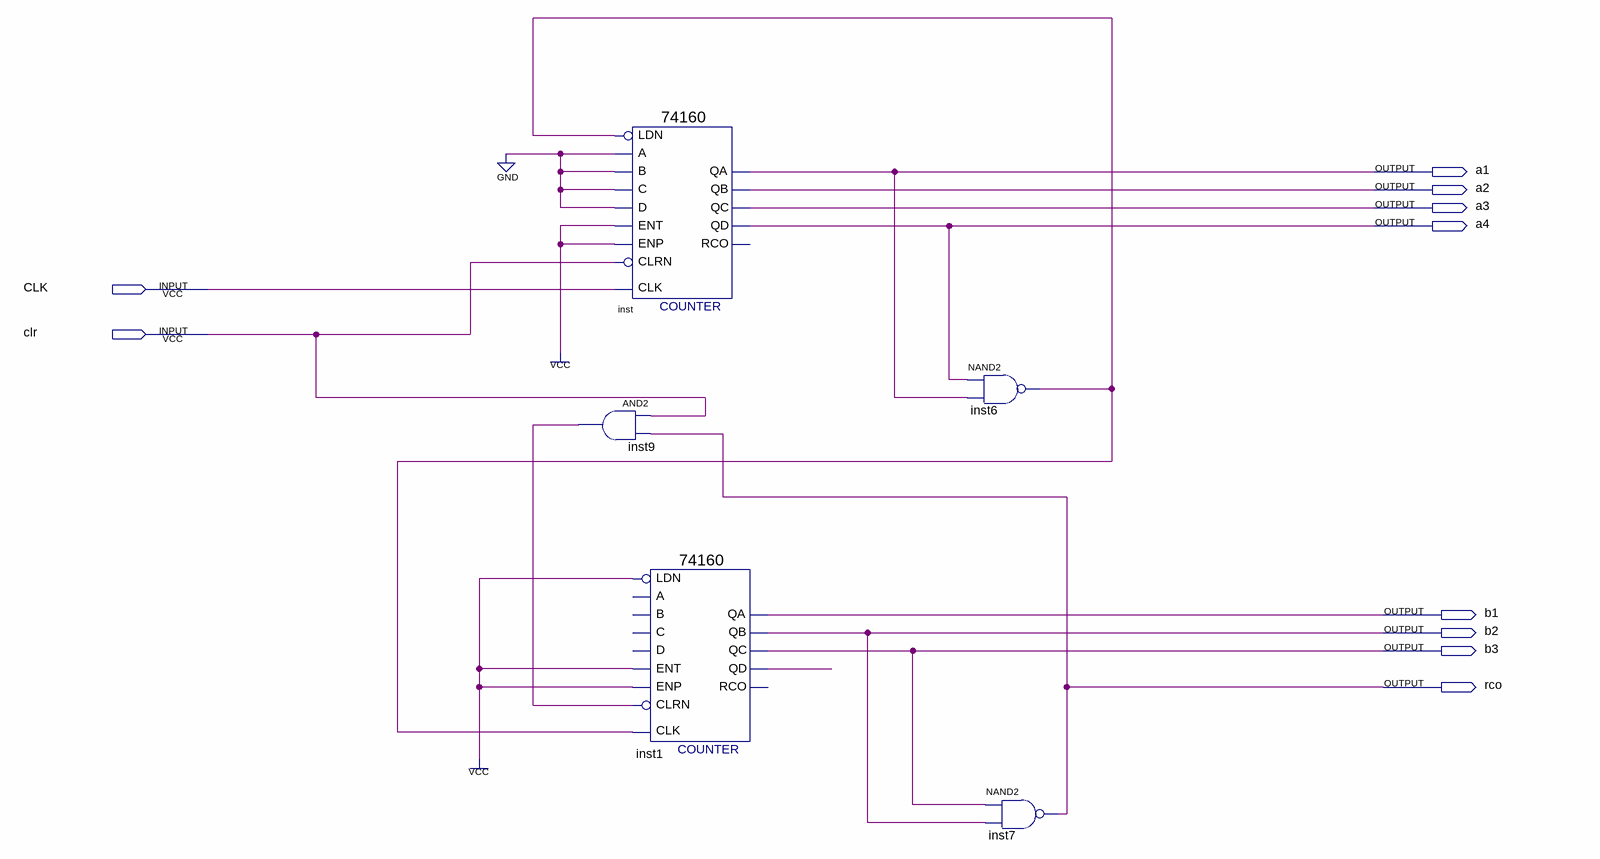
[diagram p0: schematic sheet]
// Quartus schematic count60.bdf as structural Verilog: 5 symbols, 10 pins
module count60 (
  input  CLK,
  input  clr,
  output a1,
  output a2,
  output a3,
  output a4,
  output b1,
  output b2,
  output b3,
  output rco
);

  wire inst1_qd, inst6_out, inst9_out;

  \74160  inst (
    .CLK(CLK), .ENT(1'b1), .A(1'b0), .B(1'b0), .C(1'b0), .D(1'b0), .LDN(inst6_out), .ENP(1'b1), .CLRN(clr),
    .QD(a4), .QA(a1), .QB(a2), .QC(a3));  // open: RCO
  and inst9 (inst9_out, clr, rco);
  \74160  inst1 (
    .CLK(inst6_out), .ENT(1'b1), .LDN(1'b1), .ENP(1'b1), .CLRN(inst9_out), .QD(inst1_qd), .QA(b1), .QB(b2),
    .QC(b3));  // open: A, B, C, D, RCO
  nand inst6 (inst6_out, a4, a1);
  nand inst7 (rco, b3, b2);
endmodule
